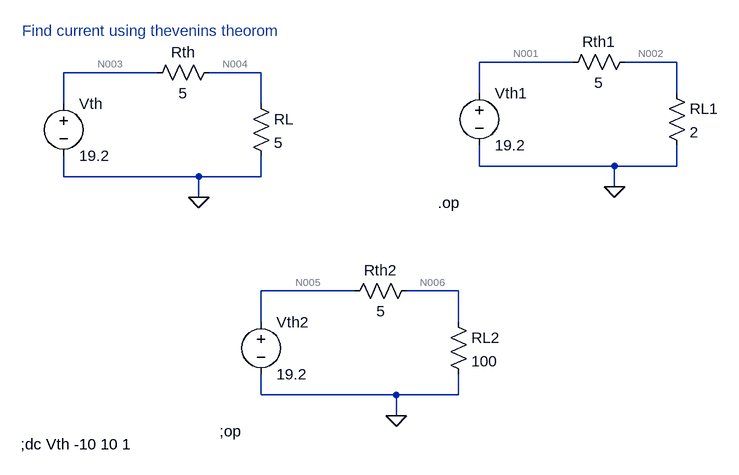
[diagram p0: schematic EEE_1_new_5.asc]
EEE_1_new_5.asc, the LTspice schematic file:
Version 4
SHEET 1 1068 700
WIRE 768 96 624 96
WIRE 928 96 848 96
WIRE 128 112 -16 112
WIRE 288 112 208 112
WIRE 624 144 624 96
WIRE 928 144 928 96
WIRE -16 160 -16 112
WIRE 288 160 288 112
WIRE 624 256 624 224
WIRE 832 256 624 256
WIRE 928 256 928 224
WIRE 928 256 832 256
WIRE -16 272 -16 240
WIRE 192 272 -16 272
WIRE 288 272 288 240
WIRE 288 272 192 272
WIRE 832 288 832 256
WIRE 192 304 192 272
WIRE 432 448 288 448
WIRE 592 448 512 448
WIRE 288 496 288 448
WIRE 592 496 592 448
WIRE 288 608 288 576
WIRE 496 608 288 608
WIRE 592 608 592 576
WIRE 592 608 496 608
WIRE 496 640 496 608
FLAG 192 304 0
FLAG 832 288 0
FLAG 496 640 0
SYMBOL voltage -16 144 R0
SYMATTR InstName Vth
SYMATTR Value 19.2
SYMBOL res 224 96 R90
WINDOW 0 0 56 VBottom 2
WINDOW 3 32 56 VTop 2
SYMATTR InstName Rth
SYMATTR Value 5
SYMBOL res 272 144 R0
SYMATTR InstName RL
SYMATTR Value 5
SYMBOL voltage 624 128 R0
SYMATTR InstName Vth1
SYMATTR Value 19.2
SYMBOL res 864 80 R90
WINDOW 0 0 56 VBottom 2
WINDOW 3 32 56 VTop 2
SYMATTR InstName Rth1
SYMATTR Value 5
SYMBOL res 912 128 R0
SYMATTR InstName RL1
SYMATTR Value 2
SYMBOL voltage 288 480 R0
SYMATTR InstName Vth2
SYMATTR Value 19.2
SYMBOL res 528 432 R90
WINDOW 0 0 56 VBottom 2
WINDOW 3 32 56 VTop 2
SYMATTR InstName Rth2
SYMATTR Value 5
SYMBOL res 576 480 R0
SYMATTR InstName RL2
SYMATTR Value 100
TEXT -80 48 Left 2 ;Find current using thevenins theorom
TEXT 560 312 Left 2 !.op
TEXT 224 664 Left 2 !;op
TEXT -82 684 Left 2 !;dc Vth -10 10 1

The netlist it stands for:
* EEE_1_new_5.asc
Vth N003 0 19.2
Rth N004 N003 5
RL N004 0 5
Vth1 N001 0 19.2
Rth1 N002 N001 5
RL1 N002 0 2
Vth2 N005 0 19.2
Rth2 N006 N005 5
RL2 N006 0 100
* Find current using thevenins theorom
.op
;op
;dc Vth -10 10 1
.backanno
.end

* Results of the author's LTspice run, read from the files saved beside the schematic
* Operating Point:
*   V(n003) = 19.2 V
*   V(n004) = 9.6 V
*   V(n001) = 19.2 V
*   V(n002) = 5.486 V
*   V(n005) = 19.2 V
*   V(n006) = 18.29 V
*   I(Rl2) = 182.9 mA
*   I(Rth2) = -182.9 mA
*   I(Rl1) = 2.743 A
*   I(Rth1) = -2.743 A
*   I(Rl) = 1.92 A
*   I(Rth) = -1.92 A
*   I(Vth2) = -182.9 mA
*   I(Vth1) = -2.743 A
*   I(Vth) = -1.92 A